# EAGLE board Zvuk9_R2 (EAGLE 7.4.0), part 1 of 2
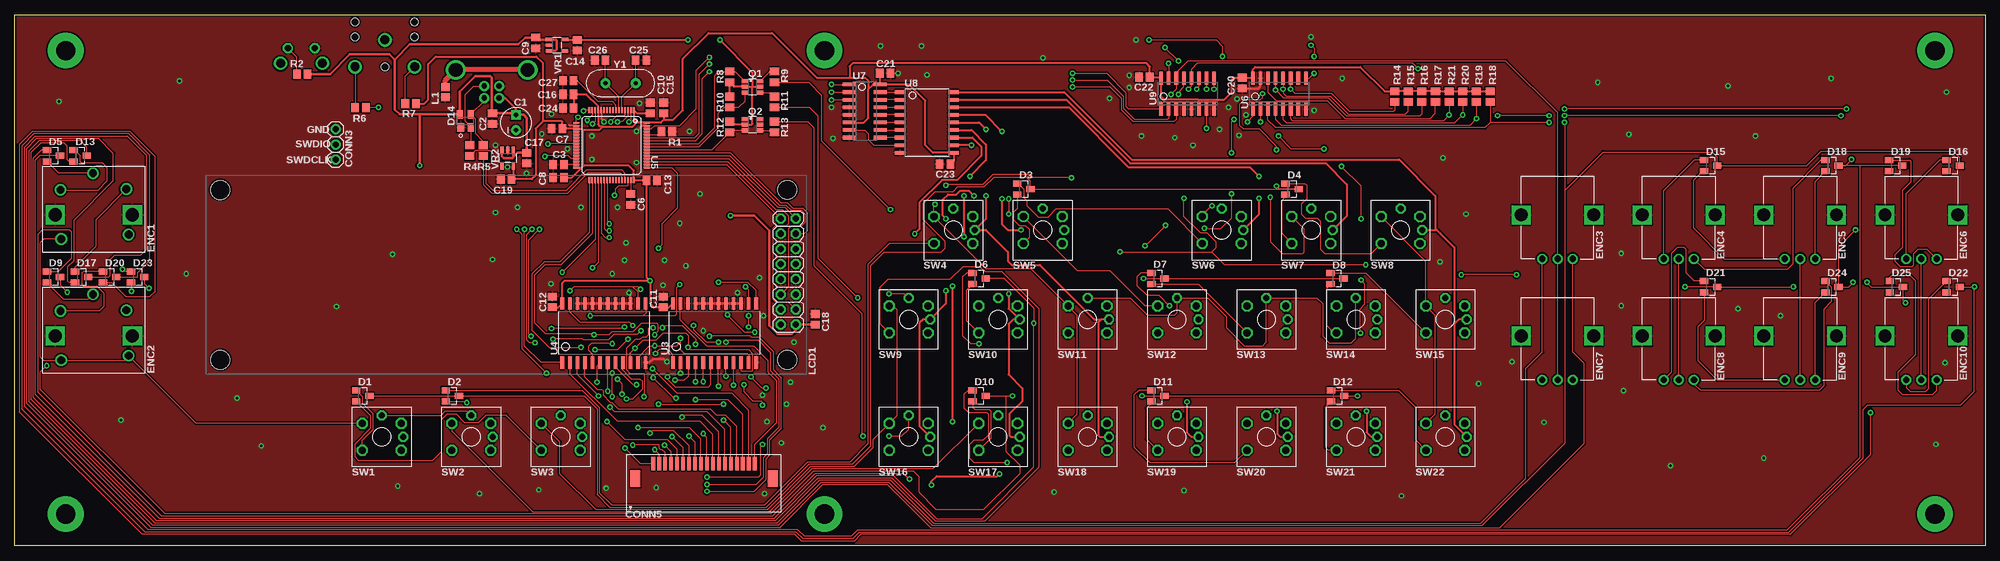
[diagram p5: board, top side]
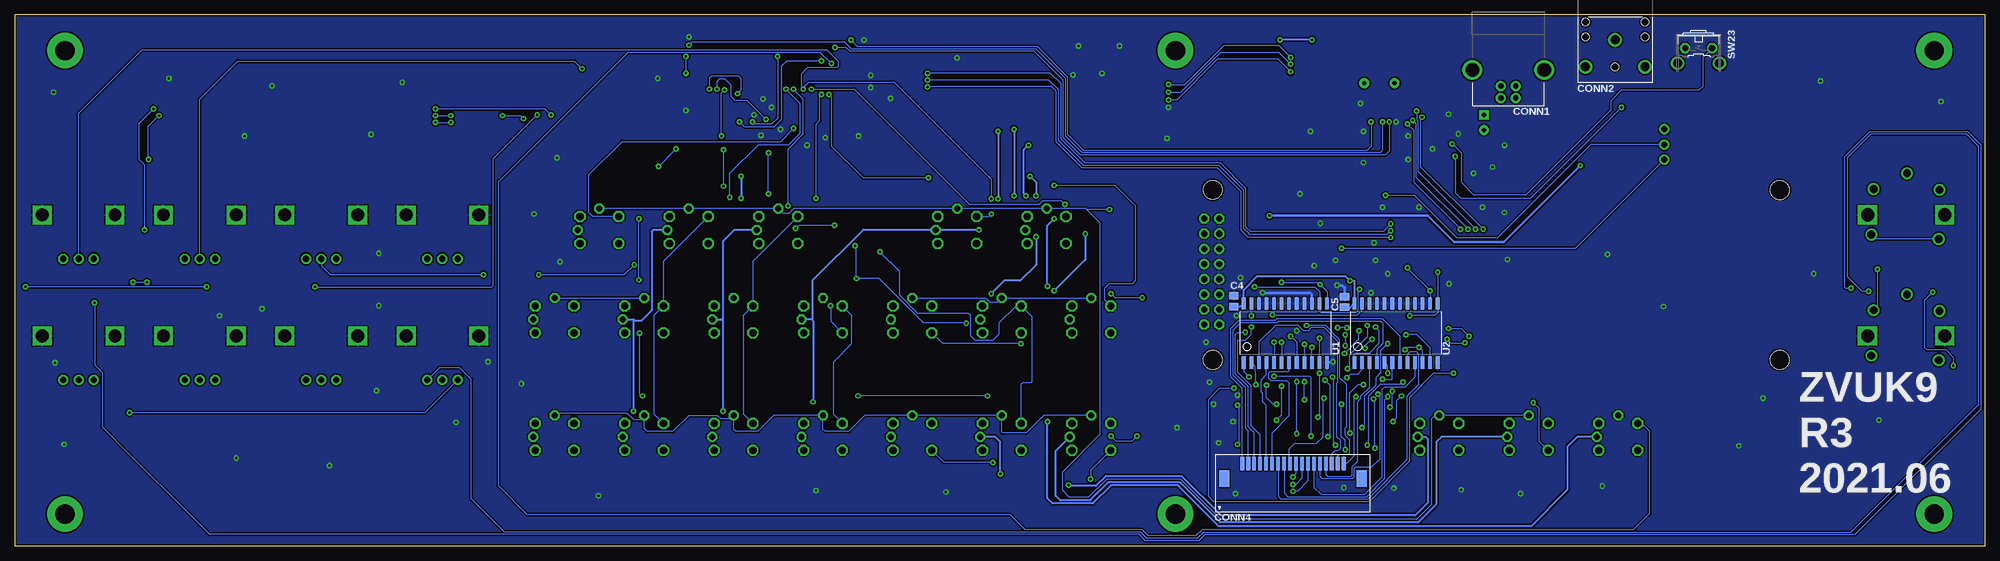
[diagram p6: board, bottom side, seen from below]

Size 330.07 x 89.03 mm. Coordinates in mm from the lower left corner, seen from the top.
Outline: 330.07,0 0,0 0,89.03 330.07,89.03 330.07,0
Copper layers (1*16): Top 0.035mm / dielectric 1.5mm / Bottom 0.035mm
Design rules "smiery *": minimum track width 8mil, minimum drill 12mil, track to track 7mil, track to pad 5mil, pad to pad 5mil, via to via 6mil, smd to smd 0mil, copper to edge 12mil, drill to drill 10mil, minimum pad ring 13mil, minimum via ring 10mil, stop-mask expansion 2mil, vias tented up to drill 25mil, thermal gap 10mil
Net classes: 0 default: width 0.203 mm; 1 POWER: width 0.61 mm

## Footprints (pad centres in the part's own frame; a part is rotated, then mirrored left to right if it is on the bottom)
C-TH-E-0502 = drill 0.7 pad 1.651 square: + 1.27,0 | drill 0.7 pad 1.651: - -1.27,0
C0805 = smd 1.27 x 1.524: 1 -0.9,0; 2 0.9,0
USB-B-PTH = drill 0.914 pad 1.676: D+ 1.25,-4.572; D- 1.25,-6.553; GND -1.25,-4.572; VBUS -1.25,-6.553 | drill 2.286: S1 -6.02,-1.854; S2 6.02,-1.854
SJ1-3523N = drill 1.5: 1 0,0; 2 -5,-4.5; 3 5,-4.5 | hole 1.3: 5,3; 5,0.5; -5,0.5; -5,3; 0,-4.5
1X03-2.54-V = drill 1.016: 1 -2.54,0; 2 0,0; 3 2.54,0
MOLEX-52271-1879 = smd 0.6 x 2.2: 1 -8.5,3.5; 2 -7.5,3.5; 3 -6.5,3.5; 4 -5.5,3.5; 5 -4.5,3.5; 6 -3.5,3.5; 7 -2.5,3.5; 8 -1.5,3.5; 9 -0.5,3.5; 10 0.5,3.5; 11 1.5,3.5; 12 2.5,3.5; 13 3.5,3.5; 14 4.5,3.5; 15 5.5,3.5; 16 6.5,3.5; 17 7.5,3.5; 18 8.5,3.5 | smd 1.65 x 2.8: S1 -11.5,1; S2 11.5,1
SOT23 = smd 1.4 x 1: 1 -1.1,0.95; 2 -1.1,-0.95; 3 1.1,0
SOT143 = smd 1.44 x 1.2: 1 -1.1,0.75 | smd 1.44 x 1: 2 -1.1,-0.95; 3 1.1,-0.95; 4 1.1,0.95
ALPS_EC12-SW = drill 1.3: A -5.588,4.064; B 5.461,4.191; C -5.461,-4.191; D 5.842,-3.429; E -0.127,6.858 | drill 2.2 square: S1 -6.477,-0.127; S2 6.477,-0.127
EC12E-1 = drill 1.016: A -2.54,-7.493; B 2.54,-7.493; C 0,-7.493 | drill 2.159 square: S1 -6.096,-0.127; S2 6.096,-0.127
L0805 = smd 1.3 x 1.5: 1 -0.85,0; 2 0.85,0
ER-OLEDM032-W = drill 1.016 octagon: 1 46.016,-8.508; 2 48.556,-8.508; 3 46.016,-5.968; 4 48.556,-5.968; 5 46.016,-3.428; 6 48.556,-3.428; 7 46.016,-0.888; 8 48.556,-0.888; 9 46.016,1.652; 10 48.556,1.652; 11 46.016,4.192; 12 48.556,4.192; 13 46.016,6.732; 14 48.556,6.732; 15 46.016,9.272; 16 48.556,9.272 | hole 3.2: 47.086,14.11; -47.867,-14.39; 47.086,-14.39; -47.879,14.09
SSOT6 = smd 0.99 x 0.69: 1 -1.3,0.95; 2 -1.3,0; 3 -1.3,-0.95; 4 1.3,-0.95; 5 1.3,0; 6 1.3,0.95
R0805 = smd 1.27 x 1.524: 1 -0.9,0; 2 0.9,0
OMRON-B3W-9 = drill 1.2 octagon: 1 -3.25,2.25; 2 3.25,2.25; 3 -3.25,-2.25; 4 3.25,-2.25 | drill 1 octagon: 6-A 0,3.6; 6-C 3.6,0
B3F-312X = drill 1.016 octagon: 1 -2.261,0.025; 2 2.261,0.025 | drill 1.499 pad 2.159: 3 -3.505,2.515; 4 3.505,2.515
SO24-W = smd 2.032 x 0.6: 1 -4.975,6.985; 2 -4.975,5.715; 3 -4.975,4.445; 4 -4.975,3.175; 5 -4.975,1.905; 6 -4.975,0.635; 7 -4.975,-0.635; 8 -4.975,-1.905; 9 -4.975,-3.175; 10 -4.975,-4.445; 11 -4.975,-5.715; 12 -4.975,-6.985; 13 4.975,-6.985; 14 4.975,-5.715; 15 4.975,-4.445; 16 4.975,-3.175; 17 4.975,-1.905; 18 4.975,-0.635; 19 4.975,0.635; 20 4.975,1.905; 21 4.975,3.175; 22 4.975,4.445; 23 4.975,5.715; 24 4.975,6.985
TQFP-64-10X10-HS = smd 1 x 0.3: 1 -5.875,3.75; 2 -5.875,3.25; 3 -5.875,2.75; 4 -5.875,2.25; 5 -5.875,1.75; 6 -5.875,1.25; 7 -5.875,0.75; 8 -5.875,0.25; 9 -5.875,-0.25; 10 -5.875,-0.75; 11 -5.875,-1.25; 12 -5.875,-1.75; 13 -5.875,-2.25; 14 -5.875,-2.75; 15 -5.875,-3.25; 16 -5.875,-3.75; 33 5.875,-3.75; 34 5.875,-3.25; 35 5.875,-2.75; 36 5.875,-2.25; 37 5.875,-1.75; 38 5.875,-1.25; 39 5.875,-0.75; 40 5.875,-0.25; 41 5.875,0.25; 42 5.875,0.75; 43 5.875,1.25; 44 5.875,1.75; 45 5.875,2.25; 46 5.875,2.75; 47 5.875,3.25; 48 5.875,3.75 | smd 0.3 x 1: 17 -3.75,-5.875; 18 -3.25,-5.875; 19 -2.75,-5.875; 20 -2.25,-5.875; 21 -1.75,-5.875; 22 -1.25,-5.875; 23 -0.75,-5.875; 24 -0.25,-5.875; 25 0.25,-5.875; 26 0.75,-5.875; 27 1.25,-5.875; 28 1.75,-5.875; 29 2.25,-5.875; 30 2.75,-5.875; 31 3.25,-5.875; 32 3.75,-5.875; 49 3.75,5.875; 50 3.25,5.875; 51 2.75,5.875; 52 2.25,5.875; 53 1.75,5.875; 54 1.25,5.875; 55 0.75,5.875; 56 0.25,5.875; 57 -0.25,5.875; 58 -0.75,5.875; 59 -1.25,5.875; 60 -1.75,5.875; 61 -2.25,5.875; 62 -2.75,5.875; 63 -3.25,5.875; 64 -3.75,5.875
SO16 = smd 2.2 x 0.6: 1 -2.6,4.445; 2 -2.6,3.175; 3 -2.6,1.905; 4 -2.6,0.635; 5 -2.6,-0.635; 6 -2.6,-1.905; 7 -2.6,-3.175; 8 -2.6,-4.445; 9 2.6,-4.445; 10 2.6,-3.175; 11 2.6,-1.905; 12 2.6,-0.635; 13 2.6,0.635; 14 2.6,1.905; 15 2.6,3.175; 16 2.6,4.445
SO18 = smd 1.8 x 0.6: 1 -4.475,5.08; 2 -4.475,3.81; 3 -4.475,2.54; 4 -4.475,1.27; 5 -4.475,0; 6 -4.475,-1.27; 7 -4.475,-2.54; 8 -4.475,-3.81; 9 -4.475,-5.08; 10 4.475,-5.08; 11 4.475,-3.81; 12 4.475,-2.54; 13 4.475,-1.27; 14 4.475,0; 15 4.475,1.27; 16 4.475,2.54; 17 4.475,3.81; 18 4.475,5.08
SOT23-5 = smd 1.2 x 0.55: 1 1.3,-0.95; 2 1.3,0; 3 1.3,0.95; 4 -1.3,0.95; 5 -1.3,-0.95
SOT25 = smd 0.55 x 1.2: 1 -0.95,-1.3; 2 0,-1.3; 3 0.95,-1.3; 4 0.95,1.3; 5 -0.95,1.3
HC49US = drill 0.7 pad 1.651: 1 -2.54,0; 2 2.54,0

## Placement (x,y rotation side)
C1  10u  [C-TH-E-0502]  83.95,70.99 90 top
C2  100n  [C0805]  80.01,71.63 270 top
C3  2.2u  [C0805]  91.06,63.93 0 top
C4  100n  [C0805]  125.86,41.02 90 bottom
C5  100n  [C0805]  107.31,40.89 90 bottom
C6  2.2u  [C0805]  103.2,58.09 270 top
C7  100n  [C0805]  90.81,69.93 180 top
C8  100n  [C0805]  91.06,61.72 180 top
C9  4.7u  [C0805]  87.25,84.33 90 top
C10  100n  [C0805]  106.43,73.41 90 top
C11  100n  [C0805]  108.58,40.89 90 top
C12  100n  [C0805]  90.04,40.89 90 top
C13  100n  [C0805]  106.68,61.21 0 top
C14  4.7u  [C0805]  94.23,83.95 270 top
C15  100n  [C0805]  108.71,73.41 90 top
C16  1u  [C0805]  92.71,75.69 180 top
C17  4.7u  [C0805]  85.72,65.02 90 top
C18  100n  [C0805]  134.11,37.97 270 top
C19  4.7u  [C0805]  82.3,61.47 180 top
C20  100n  [C0805]  205.61,77.6 90 top
C21  100n  [C0805]  145.8,79.25 180 top
C22  100n  [C0805]  189.23,78.61 0 top
C23  100n  [C0805]  155.83,64.01 180 top
C24  100n  [C0805]  92.71,73.41 180 top
C25  18p  [C0805]  104.9,81.41 0 top
C26  18p  [C0805]  98.04,81.41 180 top
C27  100n  [C0805]  92.71,77.98 180 top
CONN1  USB-B-H  [USB-B-PTH]  79.88,81.66 0 bottom
CONN2  MIDI out  [SJ1-3523N]  61.98,84.84 0 bottom
CONN3  PINHD-1X03-TH-2.54MM  [1X03-2.54-V]  53.72,67.31 90 top
CONN4  PINHD-1X18-FFC-SMD-1MM  [MOLEX-52271-1879]  115.95,10.29 0 bottom
CONN5  PINHD-1X18-FFC-SMD-1MM  [MOLEX-52271-1879]  115.44,10.29 0 top
D1  BAW56  [SOT23]  58.29,25.15 0 top
D2  BAW56  [SOT23]  73.28,25.15 0 top
D3  BAW56  [SOT23]  169.04,59.82 0 top
D4  BAW56  [SOT23]  214,59.82 0 top
D5  BAW56  [SOT23]  6.48,65.41 0 top
D6  BAW56  [SOT23]  161.54,44.83 0 top
D7  BAW56  [SOT23]  191.52,44.83 0 top
D8  BAW56  [SOT23]  221.49,44.83 0 top
D9  BAW56  [SOT23]  6.48,45.09 0 top
D10  BAW56  [SOT23]  161.54,25.15 0 top
D11  BAW56  [SOT23]  191.52,25.15 0 top
D12  BAW56  [SOT23]  221.62,25.15 0 top
D13  BAW56  [SOT23]  10.92,65.41 0 top
D14  PRTR5V0U2X  [SOT143]  75.44,71.25 90 top
D15  BAW56  [SOT23]  284.1,63.75 0 top
D16  BAW56  [SOT23]  324.74,63.75 0 top
D17  BAW56  [SOT23]  11.18,45.09 0 top
D18  BAW56  [SOT23]  304.42,63.75 0 top
D19  BAW56  [SOT23]  315.09,63.75 0 top
D20  BAW56  [SOT23]  15.88,45.09 0 top
D21  BAW56  [SOT23]  284.1,43.43 0 top
D22  BAW56  [SOT23]  324.74,43.43 0 top
D23  BAW56  [SOT23]  20.57,45.09 0 top
D24  BAW56  [SOT23]  304.42,43.43 0 top
D25  BAW56  [SOT23]  315.21,43.43 0 top
ENC1  ALPS-EC12D1524403  [ALPS_EC12-SW]  13.21,55.63 0 top
ENC2  ALPS-EC12D1524403  [ALPS_EC12-SW]  13.21,35.31 0 top
ENC3  ALPS-EC12E24404AX  [EC12E-1]  258.44,55.63 0 top
ENC4  ALPS-EC12E24404AX  [EC12E-1]  278.76,55.63 0 top
ENC5  ALPS-EC12E24404AX  [EC12E-1]  299.08,55.63 0 top
ENC6  ALPS-EC12E24404AX  [EC12E-1]  319.4,55.63 0 top
ENC7  ALPS-EC12E24404AX  [EC12E-1]  258.44,35.31 0 top
ENC8  ALPS-EC12E24404AX  [EC12E-1]  278.76,35.31 0 top
ENC9  ALPS-EC12E24404AX  [EC12E-1]  299.08,35.31 0 top
ENC10  ALPS-EC12E24404AX  [EC12E-1]  319.4,35.31 0 top
L1  FERRITE_BEAD-BLM21PG221SN1D  [L0805]  72.14,76.07 270 top
LCD1  ER-OLEDM032-1  [ER-OLEDM032-W]  82.3,45.59 0 top
Q1  FDC6312P  [SSOT6]  123.57,76.96 0 top
Q2  FDC6312P  [SSOT6]  123.57,70.61 0 top
R1  510  [R0805]  109.22,69.44 0 top
R2  4.7k  [R0805]  48.13,79.12 0 top
R4  22  [R0805]  76.2,66.29 90 top
R5  22  [R0805]  78.49,66.29 90 top
R6  10  [R0805]  57.89,73.51 0 top
R7  33  [R0805]  66.29,74.17 0 top
R8  4.7k  [R0805]  119.76,78.61 90 top
R9  22  [R0805]  127.25,78.61 270 top
R10  4.7k  [R0805]  119.76,74.42 270 top
R11  22  [R0805]  127.25,74.42 270 top
R12  4.7k  [R0805]  119.76,70.23 270 top
R13  22  [R0805]  127.25,70.23 90 top
R14  4.7k  [R0805]  231.14,75.31 90 top
R15  4.7k  [R0805]  233.43,75.31 90 top
R16  4.7k  [R0805]  235.71,75.31 90 top
R17  4.7k  [R0805]  238,75.31 90 top
R18  4.7k  [R0805]  247.14,75.31 90 top
R19  4.7k  [R0805]  244.86,75.31 90 top
R20  4.7k  [R0805]  242.57,75.31 90 top
R21  4.7k  [R0805]  240.28,75.31 90 top
SW1  OMRON-B3W-9  [OMRON-B3W-9]  61.47,18.29 0 top
SW2  OMRON-B3W-9  [OMRON-B3W-9]  76.45,18.29 0 top
SW3  OMRON-B3W-9  [OMRON-B3W-9]  91.44,18.29 0 top
SW4  OMRON-B3W-9  [OMRON-B3W-9]  157.23,52.96 0 top
SW5  OMRON-B3W-9  [OMRON-B3W-9]  172.21,52.96 0 top
SW6  OMRON-B3W-9  [OMRON-B3W-9]  202.18,52.96 0 top
SW7  OMRON-B3W-9  [OMRON-B3W-9]  217.17,52.96 0 top
SW8  OMRON-B3W-9  [OMRON-B3W-9]  232.16,52.96 0 top
SW9  OMRON-B3W-9  [OMRON-B3W-9]  149.73,37.97 0 top
SW10  OMRON-B3W-9  [OMRON-B3W-9]  164.72,37.97 0 top
SW11  OMRON-B3W-9  [OMRON-B3W-9]  179.71,37.97 0 top
SW12  OMRON-B3W-9  [OMRON-B3W-9]  194.69,37.97 0 top
SW13  OMRON-B3W-9  [OMRON-B3W-9]  209.68,37.97 0 top
SW14  OMRON-B3W-9  [OMRON-B3W-9]  224.66,37.97 0 top
SW15  OMRON-B3W-9  [OMRON-B3W-9]  239.65,37.97 0 top
SW16  OMRON-B3W-9  [OMRON-B3W-9]  149.73,18.29 0 top
SW17  OMRON-B3W-9  [OMRON-B3W-9]  164.72,18.29 0 top
SW18  OMRON-B3W-9  [OMRON-B3W-9]  179.71,18.29 0 top
SW19  OMRON-B3W-9  [OMRON-B3W-9]  194.69,18.29 0 top
SW20  OMRON-B3W-9  [OMRON-B3W-9]  209.68,18.29 0 top
SW21  OMRON-B3W-9  [OMRON-B3W-9]  224.66,18.29 0 top
SW22  OMRON-B3W-9  [OMRON-B3W-9]  239.65,18.29 0 top
SW23  [B3F-312X]  48.01,83.44 180 bottom
U1  MC14067BDWR2G-SO24W  [SO24-W]  117.22,35.69 90 bottom
U2  MC14067BDWR2G-SO24W  [SO24-W]  98.68,35.69 90 bottom
U3  MC14067BDWR2G-SO24W  [SO24-W]  117.22,35.69 90 top
U4  MC14067BDWR2G-SO24W  [SO24-W]  98.68,35.69 90 top
U5  STM32F405RGT6-10X10-HS  [TQFP-64-10X10-HS]  99.95,67.18 270 top
U6  74HC165  [SO16]  211.84,75.82 90 top
U7  74238-SO  [SO16]  142.37,72.9 0 top
U8  ULN2803A-SO  [SO18]  152.78,70.99 0 top
U9  74138-SO  [SO16]  196.47,75.82 90 top
VR1  LP5907-4.5V  [SOT23-5]  90.81,83.95 180 top
VR2  AP7343-SOT25  [SOT25]  82.55,65.02 180 top
Y1  16MHz  [HC49US]  101.47,77.6 180 top